# Altium schematic sheet EPS.SchDoc
size A
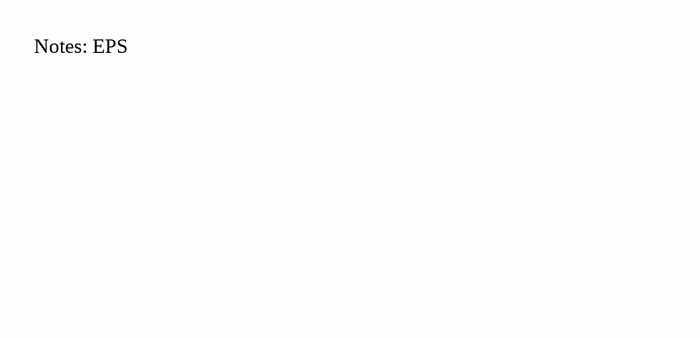
[diagram p0: EPS.SchDoc]

## Notes on the sheet
- Notes: EPS